# EAGLE design sensor_board_v10 (EAGLE 6.2)
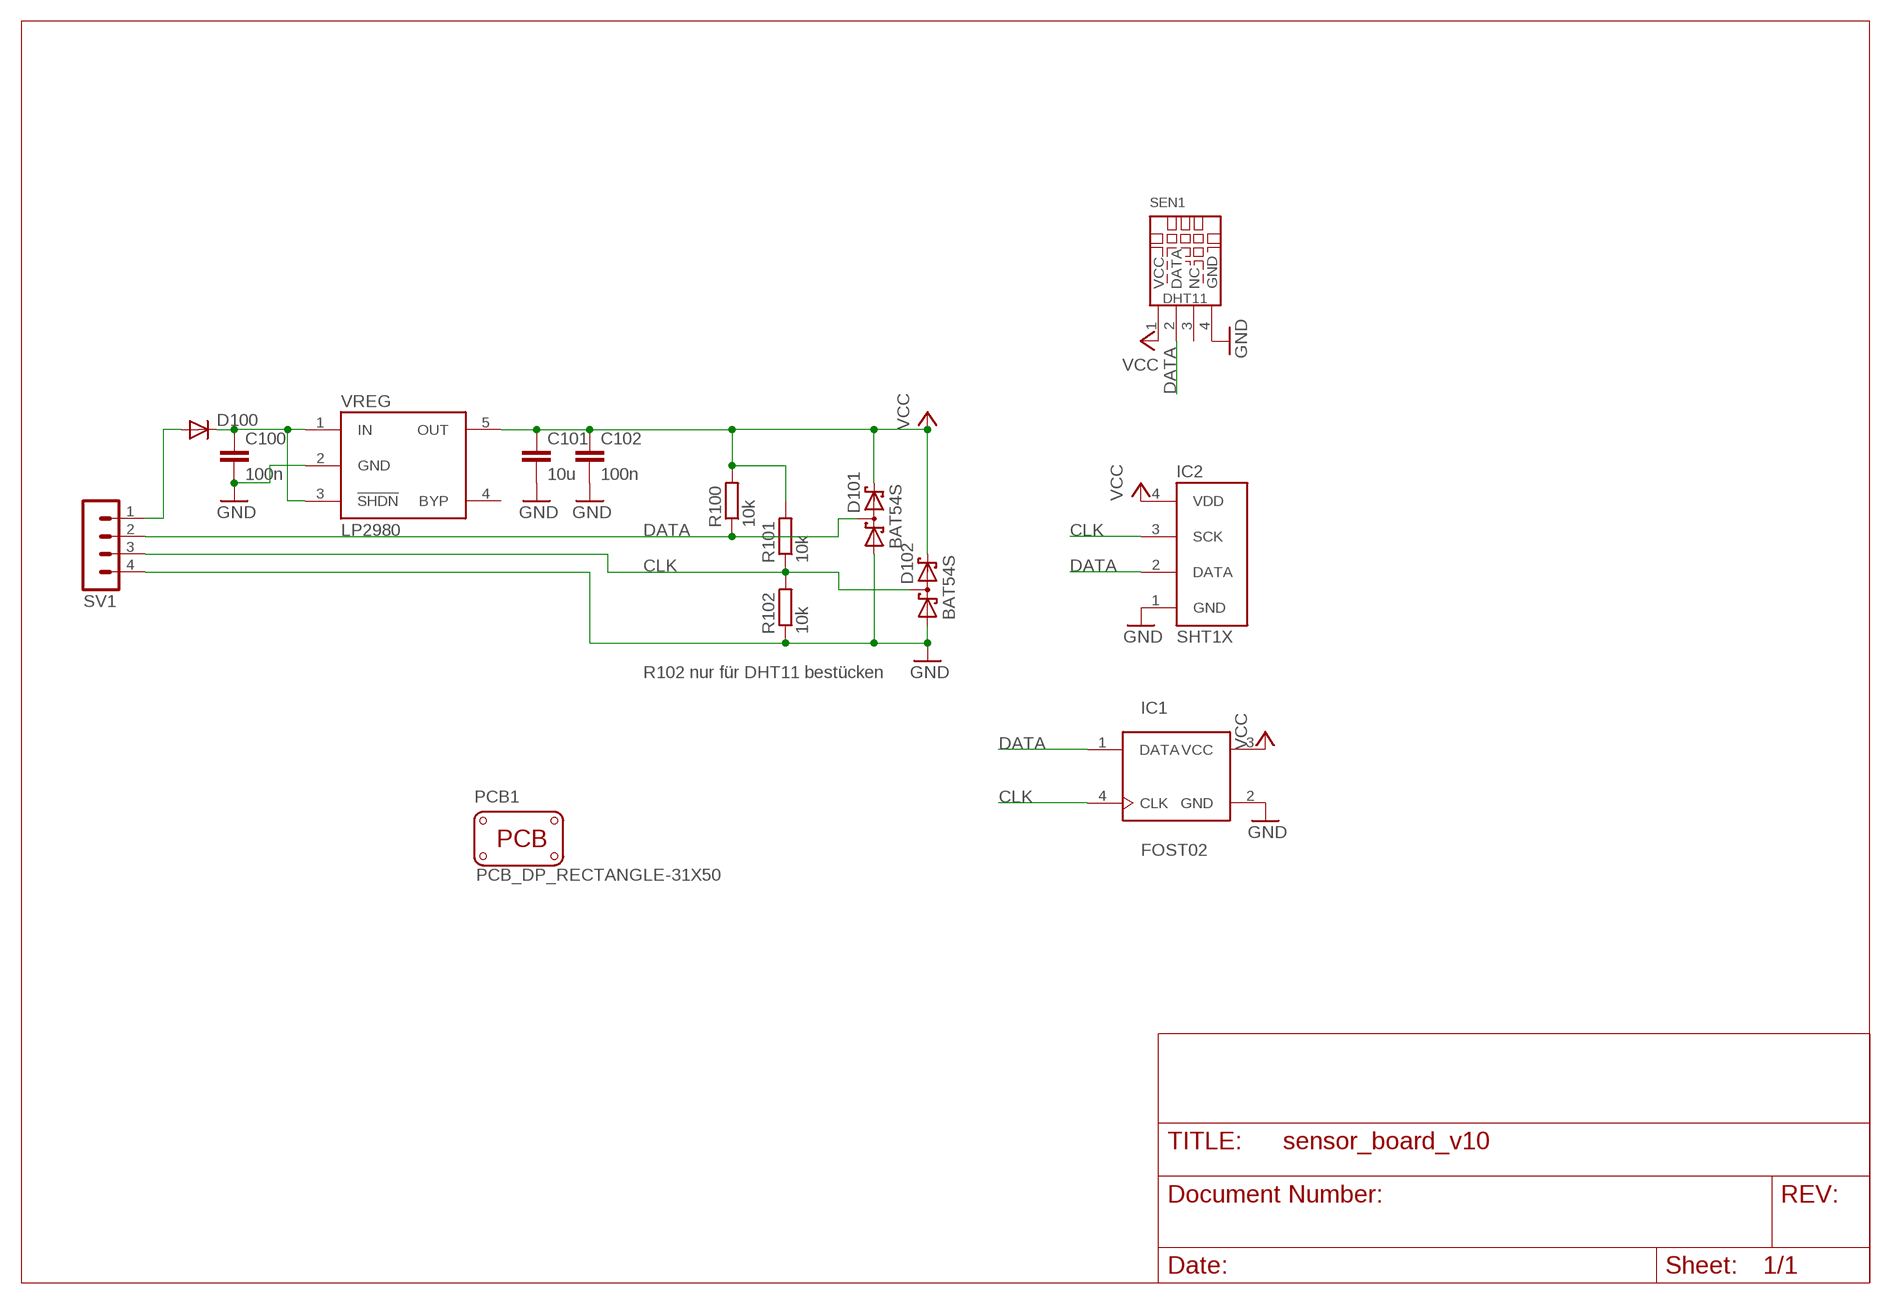
[diagram p0: schematic, sheet 1]

## Parts
C100  100n  C-EUC0805  [C0805]
C101  10u  C-EUC0805  [C0805]
C102  100n  C-EUC0805  [C0805]
D100  DIODE-SOD123  [SOD123]
D101  BAT54S  [SOT23]
D102  BAT54S  [SOT23]
IC1  FOST02  [FOST02]
IC2  SHT1X  [SHT1X]
PCB1  PCB_DP_RECTANGLE-31X50  [DP5031_V1]
R100  10k  R-EU_R0805  [R0805]
R101  10k  R-EU_R0805  [R0805]
R102  10k  R-EU_R0805  [R0805]
SEN1  DHT11  [DHT11]
SV1  MA04-1  [MA04-1]
VREG  LP2980  TC1185-SOT-23-5  [SOT-23-5]

## Nets
CLK: D102.3(C1A2) IC1.4(CLK) IC2.3(SCK) R101.1 R102.2 SV1.3
DATA: D101.3(C1A2) IC1.1(DATA) IC2.2(DATA) R100.1 SEN1.2(DATA) SV1.2
GND: C100.2 C101.2 C102.2 D101.1(A1) D102.1(A1) IC1.2(GND) IC2.1(GND) R102.1 SEN1.4(GND) SV1.4 VREG.2(GND)
N$1: C100.1 D100.C VREG.1(IN) VREG.3(!SHDN)
N$6: D100.A SV1.1
VCC: C101.1 C102.1 D101.2(C2) D102.2(C2) IC1.3(VCC) IC2.4(VDD) R100.2 R101.2 SEN1.1(VCC) VREG.5(OUT)
Unconnected: SEN1.3(NC) VREG.4(BYP)

## Notes on the sheet
- R102 nur für DHT11 bestücken

## Library data of the parts
C100-C102 = rcl:C-EU: CAPACITOR, European symbol
D100 = ferdinandkeil:DIODE-: DIODE
D101 D102 = diode:BAT54S: Schottky Diodes Pin connection corrected 2011-05-04 Source: Fairchild .. BAT54.pdf
IC1 = ferdinandkeil:FOST02
IC2 = ferdinandkeil:SHT1X
PCB1 = ferdinandkeil:PCB_DP_RECTANGLE: Dangerous Prototypes Standard Rectangular PCB sizes
R100-R102 = rcl:R-EU_: RESISTOR, European symbol
SEN1 = ferdinandkeil:DHT: DHTXX Humidity & Temperature Sensors DHT11: 20-80% relH @ 5% accuracy, 0-50C @ 2,0C accuracy DHT22: 0-100% relH @ 2-5% accuracy, -40-125C @ 0,5C accuracy Sources http://learn.adafruit.com/dht/overview http://www.adafruit.com/datasheets/DHT11-chinese.pdf http://www.adafruit.com/datasheets/DHT22.pdf
SV1 = con-lstb:MA04-1: PIN HEADER; OC_FARNELL: unknown; OC_NEWARK: unknown
VREG = ferdinandkeil:TC1185: 5 pins voltage regulator

## Board
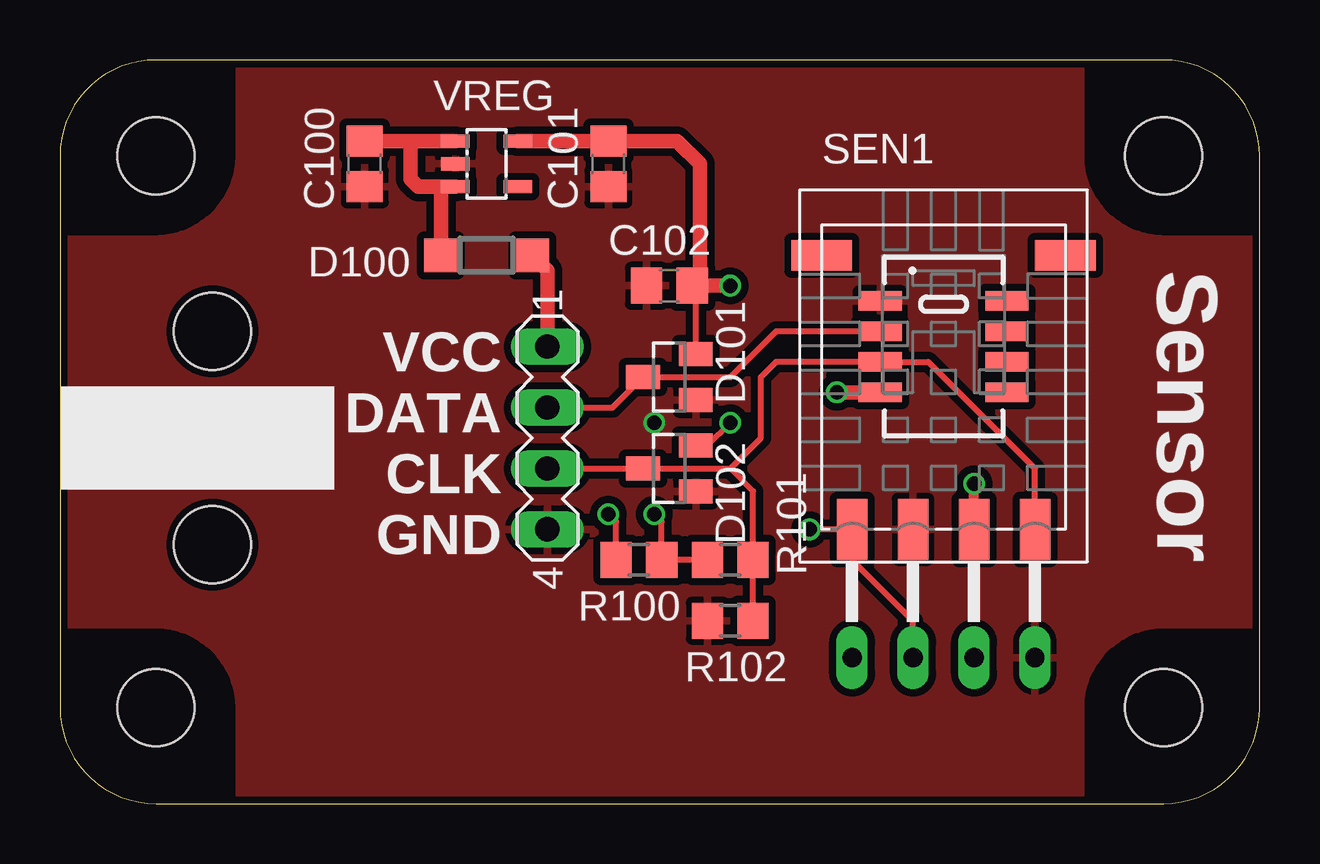
[diagram p1: board, top side]
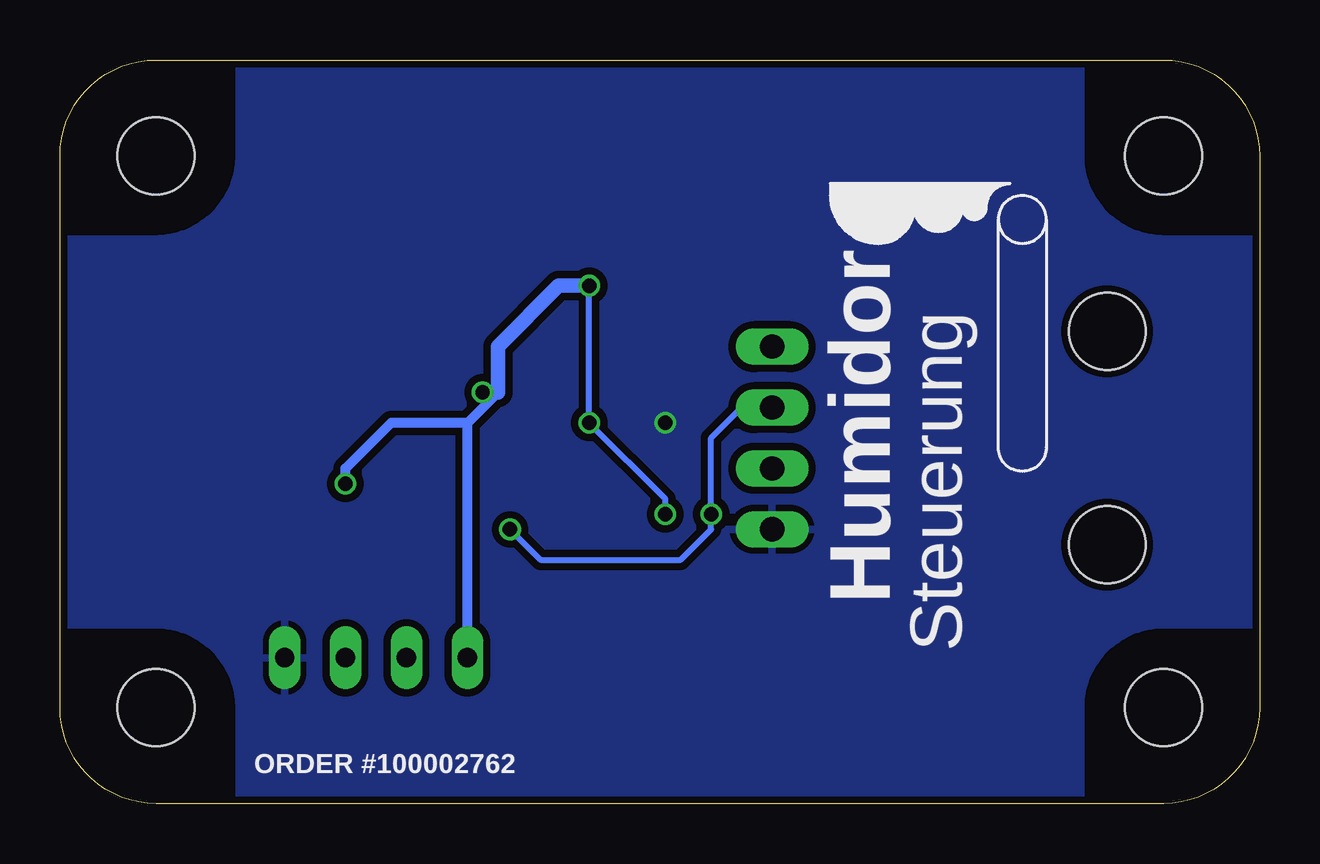
[diagram p2: board, bottom side, seen from below]

Size 50 x 31 mm. Coordinates in mm from the lower left corner, seen from the top.
Copper layers (1*16): Top 0.035mm / dielectric 1.5mm / Bottom 0.035mm
Design rules: minimum track width 6mil, minimum drill 12mil, track to track 6mil, track to pad 6mil, pad to pad 6mil, via to via 6mil, smd to smd 0mil, copper to edge 10mil, drill to drill 10mil, minimum pad ring 10mil, minimum via ring 6mil, stop-mask expansion 2mil, vias tented up to drill 100mil, thermal gap 10mil
Holes 3.2 mm at 6.35,19.68 6.35,10.79

### Footprints (pad centres in the part's own frame; a part is rotated, then mirrored left to right if it is on the bottom)
C0805 = smd 1.3 x 1.5: 1 -0.95,0; 2 0.95,0
SOD123 = smd 1.4 x 1.4: A 1.9,0; C -1.9,0
SOT23 = smd 1 x 1.4: 1 -0.95,-1.1; 2 0.95,-1.1; 3 0,1.1
FOST02 = smd 1.27 x 2.54: 1 -3.81,-10.16; 2 -1.27,-10.16; 3 1.27,-10.16; 4 3.81,-10.16 | smd 2.54 x 1.27: 5 -5.08,1.27; 6 5.08,1.27
SHT1X = smd 1.803 x 0.8: 1 -2.642,1.905; 2 -2.642,0.635; 3 -2.642,-0.635; 4 -2.642,-1.905; 5 2.642,-1.905; 6 2.642,-0.635; 7 2.642,0.635; 8 2.642,1.905
DP5031_V1 = hole 3.2: 4,4; 46,4; 46,27; 4,27
R0805 = smd 1.3 x 1.5: 1 -0.95,0; 2 0.95,0
DHT11 = drill 0.8 long: 1 -3.81,1; 2 -1.27,1; 3 1.27,1; 4 3.81,1
MA04-1 = drill 1.016 long: 1 -3.81,0; 2 -1.27,0; 3 1.27,0; 4 3.81,0
SOT-23-5 = smd 0.55 x 1.2: 1 -0.95,-1.3; 2 0,-1.3; 3 0.95,-1.3; 4 0.95,1.3; 5 -0.95,1.3

### Placement (x,y rotation side)
C100  12.7,26.67 270 top
C101  22.86,26.67 270 top
C102  25.4,21.59 180 top
D100  17.78,22.86 0 top
D101  25.4,17.78 90 top
D102  25.4,13.97 90 top
IC1  36.83,21.59 0 top
IC2  36.83,19.05 0 top
PCB1  0,0 0 top
R100  24.13,10.16 0 top
R101  27.94,10.16 180 top
R102  27.94,7.62 0 top
SEN1  36.83,5.08 0 top
SV1  20.32,15.24 270 top
U$1  [ICON_LOGO_HUMI_CONTR]  8.89,6.35 90 bottom
VREG  17.78,26.67 270 top

### Tracks (layer width: path | path; a pad name or v marks a point on that pad's centre or on a via)
CLK
  Top 0.254: SV1.3 D102.3 27.94,13.97 | 27.94,13.97 29.21,15.24 29.21,17.78 29.84,18.41 IC2.3 36.2,18.41 40.64,13.97 IC1.4 | R102.2 R101.1 28.89,13.02 27.94,13.97
DATA  (via drill 0.6)
  Top 0.254: SV1.2 23.03,16.51 D101.3 27.94,17.78 29.84,19.68 IC2.2 | SEN1.2 35.56,7.62 33.02,10.16 IC1.1 v31.24,11.43 | R100.1 23.18,11.74 v22.86,12.06
  Bottom 0.254: SV1.2 21.59,16.51 22.86,15.24 v22.86,12.06 22.86,11.43 24.13,10.16 29.97,10.16 v31.24,11.43
GND  (via drill 0.6)
  other vias: 24.77,15.88
  pour Top (isolate 0.305): 50.8,31.75 50.8,0 0,0 0,31.75
  pour Bottom (isolate 0.305): 50.8,31.75 50.8,0 0,0 0,31.75
N$1
  Top 0.61: D100.C 15.88,25.71 15.88,25.72 | C100.1 14.61,27.62 | 14.61,27.62 VREG.1 | VREG.3 15.88,25.72 | 15.88,25.72 14.92,25.72 14.61,26.04 14.61,27.62
N$6
  Top 0.61: SV1.1 20.32,22.22 D100.A
VCC  (via drill 0.6)
  Top 0.254: D101.2 26.5,21.44 C102.1 | D102.2 26.98,14.92 v27.94,15.88 | v24.77,12.06 25.08,11.75 R100.2 R101.2
  Top 0.406: IC1.3 v38.1,13.34
  Top 0.61: VREG.5 C101.1 25.72,27.62 26.67,26.67 26.67,21.91 C102.1 v27.94,21.59 | v32.38,17.14 IC2.4
  Bottom 0.254: v27.94,21.59 v27.94,15.88 24.77,12.7 v24.77,12.06
  Bottom 0.406: SEN1.1 33.02,15.88 | 33.02,15.88 31.75,17.14 | v38.1,13.34 38.1,13.97 36.2,15.88 33.02,15.88
  Bottom 0.61: v27.94,21.59 29.21,21.59 31.75,19.05 31.75,17.14 v32.38,17.14

### Text on the board
tPlace: Sensor | VCC | DATA | CLK | GND
bPlace: ORDER #100002762
bStop: v10